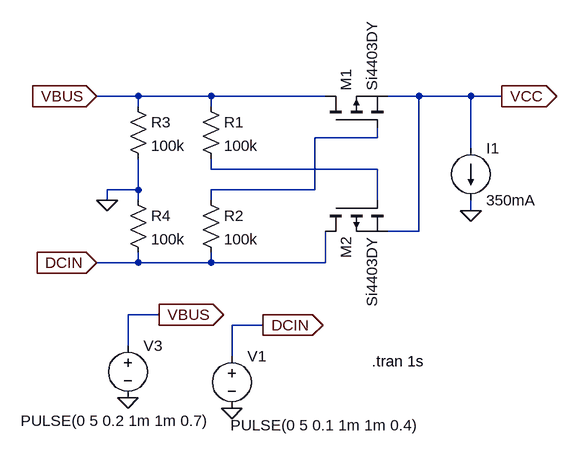
[diagram p0: schematic PowerMux.asc]
PowerMux.asc, the LTspice schematic file:
Version 4
SHEET 1 1116 680
WIRE 320 -32 256 -32
WIRE 432 -32 320 -32
WIRE 608 -32 432 -32
WIRE 752 -32 704 -32
WIRE 832 -32 752 -32
WIRE 880 -32 832 -32
WIRE 320 -16 320 -32
WIRE 432 -16 432 -32
WIRE 688 32 688 16
WIRE 688 32 592 32
WIRE 832 48 832 -32
WIRE 432 80 432 64
WIRE 688 80 432 80
WIRE 320 112 320 64
WIRE 320 112 272 112
WIRE 592 112 592 32
WIRE 592 112 432 112
WIRE 272 128 272 112
WIRE 320 128 320 112
WIRE 432 128 432 112
WIRE 688 128 688 80
WIRE 832 144 832 128
WIRE 752 176 752 -32
WIRE 752 176 704 176
WIRE 320 224 320 208
WIRE 320 224 256 224
WIRE 432 224 432 208
WIRE 432 224 320 224
WIRE 608 224 608 176
WIRE 608 224 432 224
WIRE 352 304 304 304
WIRE 512 320 464 320
WIRE 304 352 304 304
WIRE 464 368 464 320
FLAG 464 448 0
FLAG 512 320 DCIN
IOPIN 512 320 Out
FLAG 304 432 0
FLAG 352 304 VBUS
IOPIN 352 304 Out
FLAG 256 -32 VBUS
IOPIN 256 -32 In
FLAG 256 224 DCIN
IOPIN 256 224 In
FLAG 272 128 0
FLAG 880 -32 VCC
IOPIN 880 -32 Out
FLAG 832 144 0
SYMBOL Voltage 464 352 R0
WINDOW 3 -2 122 Left 2
SYMATTR InstName V1
SYMATTR Value PULSE(0 5 0.1 1m 1m 0.4)
SYMBOL Voltage 304 336 R0
WINDOW 3 -165 131 Left 2
SYMATTR InstName V3
SYMATTR Value PULSE(0 5 0.2 1m 1m 0.7)
SYMBOL pmos 608 16 R270
SYMATTR InstName M1
SYMATTR Value Si4403DY
SYMBOL pmos 608 128 M90
SYMATTR InstName M2
SYMATTR Value Si4403DY
SYMBOL Res 416 -32 R0
SYMATTR InstName R1
SYMATTR Value 100k
SYMBOL Res 416 112 R0
SYMATTR InstName R2
SYMATTR Value 100k
SYMBOL Res 304 -32 R0
SYMATTR InstName R3
SYMATTR Value 100k
SYMBOL Res 304 112 R0
SYMATTR InstName R4
SYMATTR Value 100k
SYMBOL current 832 48 R0
SYMATTR InstName I1
SYMATTR Value 350mA
TEXT 680 376 Left 2 !.tran 1s

The netlist it stands for:
* PowerMux.asc
V1 DCIN 0 PULSE(0 5 0.1 1m 1m 0.4)
V3 VBUS 0 PULSE(0 5 0.2 1m 1m 0.7)
M1 VBUS N001 VCC VCC Si4403DY
M2 DCIN N002 VCC VCC Si4403DY
R1 VBUS N002 100k
R2 N001 DCIN 100k
R3 VBUS 0 100k
R4 0 DCIN 100k
I1 VCC 0 350mA
.model NMOS NMOS
.model PMOS PMOS
.lib standard.mos
.tran 1s
.backanno
.end